# Altium project WifiAndLcd.PrjPCB
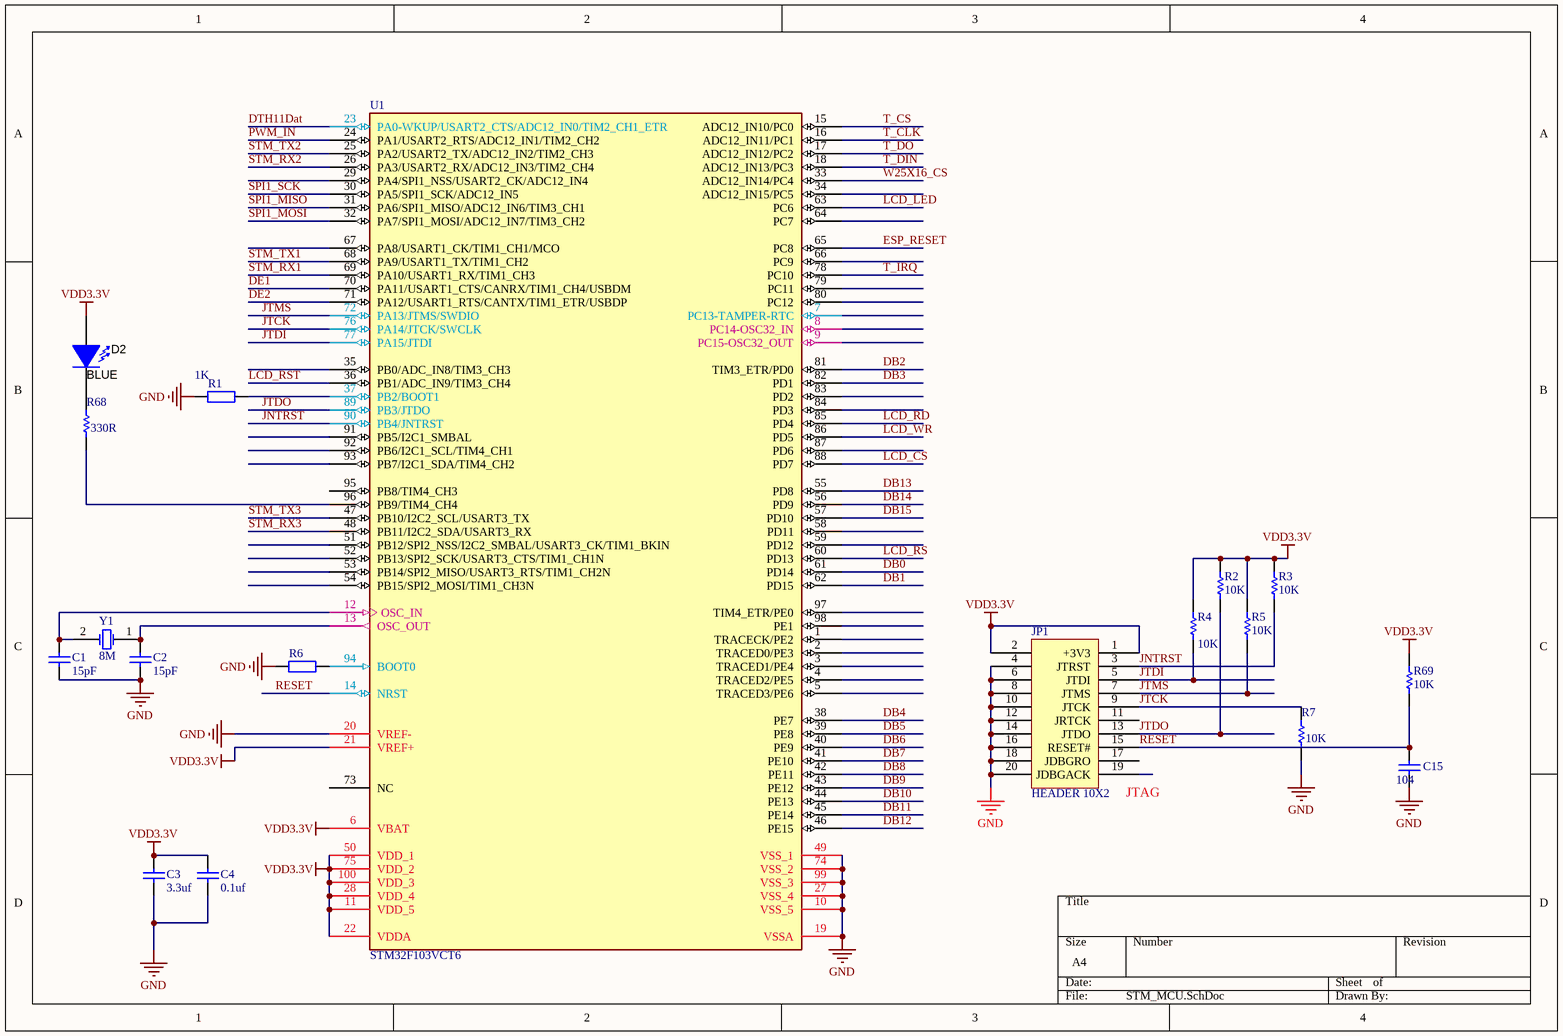
[diagram p0: STM_MCU.SchDoc]
3 sheets, 130 parts. Net scope: global (net labels, ports and power ports of the same name join across sheets).
Board file: WifiAndLcd.PcbDoc
Sheets:
  STM_MCU.SchDoc
  MAX485.SchDoc
  WifiAndPower.SchDoc

## Sheet STM_MCU.SchDoc
size A4

### Parts
C1  value 15pF  [C0805]  (hidden comment: Cap)
C2  value 15pF  [C0805]  (hidden comment: Cap)
C3  value 3.3uf  [C0805]  (hidden comment: Cap)
C4  value 0.1uf  [C0805]  (hidden comment: Cap)
C15  104  [C0805]
D2  value BLUE  [D0805]  (hidden comment: SML-P12YTT86)
JP1  HEADER 10X2  [STM32-JLINK]
R1  value 1K  [0805]  (hidden comment: Res2)
R2  value 10K  [0805]  (hidden comment: Res Semi)
R3  value 10K  [0805]  (hidden comment: Res Semi)
R4  value 10K  [0805]  (hidden comment: Res Semi)
R5  value 10K  [0805]  (hidden comment: Res Semi)
R6  Res2  [0805]  (value not drawn)
R7  value 10K  [0805]  (hidden comment: Res Semi)
R68  value 330R  [0805]  (hidden comment: Res Semi)
R69  10K  [0805]
U1  STM32F103VCT6  [LQFP100_M]
Y1  XTAL  [CY]  (value not drawn)

### Nets
GND: C1.1 C2.1 C3.2 C4.2 C15.1 JP1.4 JP1.6 JP1.8 JP1.10 JP1.12 JP1.14 JP1.16 JP1.18 JP1.20 R1.1 R6.1 R7.1 U1.10(VSS_5) U1.19(VSSA) U1.20(VREF-) U1.27(VSS_4) U1.49(VSS_1) U1.74(VSS_2) U1.99(VSS_3)
VDD3.3V: C3.1 C4.1 D2.1(A) JP1.1(+3V3) JP1.2 R2.2 R3.2 R4.2 R5.2 R69.2 U1.6(VBAT) U1.11(VDD_5) U1.21(VREF+) U1.22(VDDA) U1.28(VDD_4) U1.50(VDD_1) U1.75(VDD_2) U1.100(VDD_3)
DB0: U1.61(PD14)
DB1: U1.62(PD15)
DB2: U1.81(TIM3_ETR/PD0)
DB3: U1.82(PD1)
DB4: U1.38(PE7)
DB5: U1.39(PE8)
DB6: U1.40(PE9)
DB7: U1.41(PE10)
DB8: U1.42(PE11)
DB9: U1.43(PE12)
DB10: U1.44(PE13)
DB11: U1.45(PE14)
DB12: U1.46(PE15)
DB13: U1.55(PD8)
DB14: U1.56(PD9)
DB15: U1.57(PD10)
DE1: U1.70(PA11/USART1_CTS/CANRX/TIM1_CH4/USBDM)
DE2: U1.71(PA12/USART1_RTS/CANTX/TIM1_ETR/USBDP)
DTH11Dat: U1.23(PA0-WKUP/USART2_CTS/ADC12_IN0/TIM2_CH1_ETR)
ESP_RESET: U1.65(PC8)
JNTRST: JP1.3(JTRST) R3.1 U1.90(PB4/JNTRST)
JTCK: JP1.9(JTCK) R7.2 U1.76(PA14/JTCK/SWCLK)
JTDI: JP1.5(JTDI) R4.1 U1.77(PA15/JTDI)
JTDO: JP1.13(JTDO) R2.1 U1.89(PB3/JTDO)
JTMS: JP1.7(JTMS) R5.1 U1.72(PA13/JTMS/SWDIO)
LCD_CS: U1.88(PD7)
LCD_LED: U1.63(PC6)
LCD_RD: U1.85(PD4)
LCD_RS: U1.60(PD13)
LCD_RST: U1.36(PB1/ADC_IN9/TIM3_CH4)
LCD_WR: U1.86(PD5)
PWM_IN: U1.24(PA1/USART2_RTS/ADC12_IN1/TIM2_CH2)
RESET: C15.2 JP1.15(RESET#) R69.1 U1.14(NRST)
SPI1_MISO: U1.31(PA6/SPI1_MISO/ADC12_IN6/TIM3_CH1)
SPI1_MOSI: U1.32(PA7/SPI1_MOSI/ADC12_IN7/TIM3_CH2)
SPI1_SCK: U1.30(PA5/SPI1_SCK/ADC12_IN5)
STM_RX1: U1.69(PA10/USART1_RX/TIM1_CH3)
STM_RX2: U1.26(PA3/USART2_RX/ADC12_IN3/TIM2_CH4)
STM_RX3: U1.48(PB11/I2C2_SDA/USART3_RX)
STM_TX1: U1.68(PA9/USART1_TX/TIM1_CH2)
STM_TX2: U1.25(PA2/USART2_TX/ADC12_IN2/TIM2_CH3)
STM_TX3: U1.47(PB10/I2C2_SCL/USART3_TX)
T_CLK: U1.16(ADC12_IN11/PC1)
T_CS: U1.15(ADC12_IN10/PC0)
T_DIN: U1.18(ADC12_IN13/PC3)
T_DO: U1.17(ADC12_IN12/PC2)
T_IRQ: U1.78(PC10)
W25X16_CS: U1.33(ADC12_IN14/PC4)
NetC1_2: C1.2 U1.12(OSC_IN) Y1.2(OSC2)
NetC2_2: C2.2 U1.13(OSC_OUT) Y1.1(OSC1)
NetD2_2: D2.2(K) R68.2
NetR1_2: R1.2 U1.37(PB2/BOOT1)
NetR6_2: R6.2 U1.94(BOOT0)
NetR68_1: R68.1 U1.96(PB9/TIM4_CH4)

Not connected (* = marked no-connect by the designer): JP1 11(JRTCK) 17(JDBGRO) 19(JDBGACK); U1 1(TRACECK/PE2) 2(TRACED0/PE3) 3(TRACED1/PE4) 4(TRACED2/PE5) 5(TRACED3/PE6) 7(PC13-TAMPER-RTC) 8(PC14-OSC32_IN) 9(PC15-OSC32_OUT) 29(PA4/SPI1_NSS/USART2_CK/ADC12_IN4) 34(ADC12_IN15/PC5) 35(PB0/ADC_IN8/TIM3_CH3) 51(PB12/SPI2_NSS/I2C2_SMBAL/USART3_CK/TIM1_BKIN) 52(PB13/SPI2_SCK/USART3_CTS/TIM1_CH1N) 53(PB14/SPI2_MISO/USART3_RTS/TIM1_CH2N) 54(PB15/SPI2_MOSI/TIM1_CH3N) 58(PD11) 59(PD12) 64(PC7) 66(PC9) 67(PA8/USART1_CK/TIM1_CH1/MCO) 73(NC) 79(PC11) 80(PC12) 83(PD2) 84(PD3) 87(PD6) 91(PB5/I2C1_SMBAL) 92(PB6/I2C1_SCL/TIM4_CH1) 93(PB7/I2C1_SDA/TIM4_CH2) 95(PB8/TIM4_CH3) 97(TIM4_ETR/PE0) 98(PE1)

### Notes on the sheet
- (near JP1) JTAG
- (in symbol XTAL) 8M

### Library data of the parts
C1 C2 = Cap: Capacitor; Published: 8-Jun-2000; LatestRevisionDate: 17-Jul-2002; LatestRevisionNote: Re-released for DXP Platform.; PackageReference: RAD-0.3; Publisher: Altium Limited
C3 C4 = Cap: Capacitor; Manufacturer: Generic Components; Class: Passive; Published: 08/06/2000; Publisher: Altium Hobart Technology Centre; SubClass: Capacitor
C15 = Cap_2: Capacitor; Published: 8-Jun-2000; LatestRevisionDate: 17-Jul-2002; LatestRevisionNote: Re-released for DXP Platform.; Publisher: Altium Limited
D2 = SML-P12YTT86: LED, GREEN SMD; Manufacturer: Rohm; Type: InGaN; Vf_V: 2.1; Value2: 2.1V; Io_A: 0.02; Tjmax_C: 85; Value1: W; Color: yellow; U/M: EA; CompType: LED; PartNumber: SML-P12YTT86; SymbolVersion: 2008-12-08; MountType: SMT; RoHS: Y; PackageReference: Yellow LED; Published: 2008-07-11; Publisher: Texas Instruments; ComponentLink1URL: http://rohmfs.rohm.com/en/products/databook/datasheet/opto/led/chip_mono/sml-p1.pdf; ComponentLink1Description: Datasheet link; LatestRevisionDate: 2013-06-24; LatestRevisionNote: Updated supplier queries; Supplier 1: Digi-Key; Supplier Part Number 1: 511-1595-1-ND; Supplier 2: Mouser; Supplier Part Number 2: 755-SML-P12YTT86; Supplier 3: Farnell; Supplier Part Number 3: 1973107
R1 = RES
R2-R5 R7 R68 R69 = Res Semi: Semiconductor Resistor; Published: 8-Jun-2000; LatestRevisionDate: 17-Jul-2002; LatestRevisionNote: Re-released for DXP Platform.; PackageReference: AXIAL-0.5; Publisher: Altium Limited
  R69: Value: 10K
R6 = RES: Value: 10K
U1 = STM32F103VBT6: STM32 ARM-based 32-bit MCU with 64 Kbytes Flash, 100-pin LQFP, Industrial Temperature; Published: *; DatasheetVersion: *; PackageVersion: *; PackageReference: *; Publisher: *; PackageDescription: *; ComponentLink1Description: *; ComponentLink1URL: *; ComponentLink2Description: *; ComponentLink2URL: *
Y1 = XTAL: Crystal Oscillator; Published: 8-Jun-2000; LatestRevisionDate: 17-Jul-2002; LatestRevisionNote: Re-released for DXP Platform.; PackageReference: R38; Publisher: Altium Limited

## Sheet MAX485.SchDoc
size A4
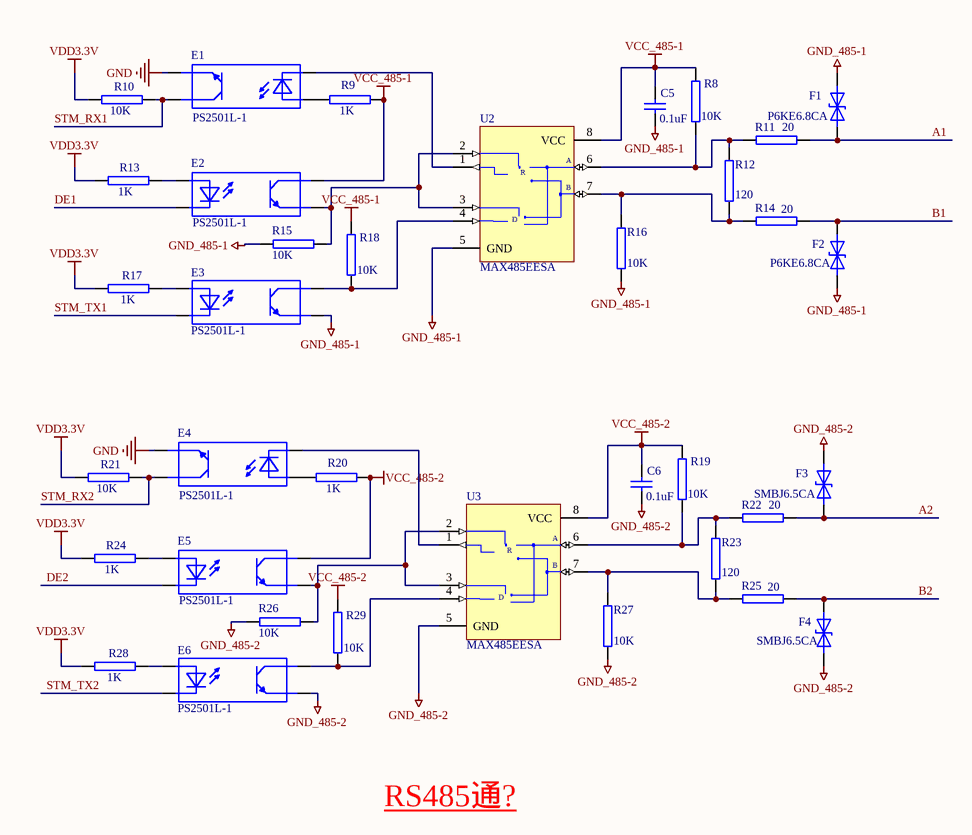
[diagram p1: MAX485.SchDoc]

### Parts
C5  value 0.1uF  [C0805]  (hidden comment: Cap)
C6  value 0.1uF  [C0805]  (hidden comment: Cap)
E1  PS2501L-1  [NEC2501]
E2  PS2501L-1  [NEC2501]
E3  PS2501L-1  [NEC2501]
E4  PS2501L-1  [NEC2501]
E5  PS2501L-1  [NEC2501]
E6  PS2501L-1  [NEC2501]
F1  P6KE6.8CA  [P6KE6,8CA]
F2  P6KE6.8CA  [P6KE6,8CA]
F3  SMBJ6.5CA  [P6KE6,8CA]
F4  SMBJ6.5CA  [P6KE6,8CA]
R8  10K  [0805]
R9  1K  [0805]
R10  10K  [0805]
R11  20  [0805]
R12  120  [0805]
R13  1K  [0805]
R14  20  [0805]
R15  10K  [0805]
R16  10K  [0805]
R17  1K  [0805]
R18  10K  [0805]
R19  10K  [0805]
R20  1K  [0805]
R21  10K  [0805]
R22  20  [0805]
R23  120  [0805]
R24  1K  [0805]
R25  20  [0805]
R26  10K  [0805]
R27  10K  [0805]
R28  1K  [0805]
R29  10K  [0805]
U2  MAX485EESA  [NSO8]
U3  MAX485EESA  [NSO8]

### Nets
GND: E1.3 E4.3
GND_485-1: C5.1 E3.3 F1.1 F2.2 R15.2 R16.1 U2.5(GND)
GND_485-2: C6.1 E6.3 F3.1 F4.2 R26.2 R27.1 U3.5(GND)
VCC_485-1: C5.2 E2.4 R8.2 R9.1 R18.2 U2.8(VCC)
VCC_485-2: C6.2 E5.4 R19.2 R20.1 R29.2 U3.8(VCC)
VDD3.3V: R10.2 R13.2 R17.2 R21.2 R24.2 R28.2
A1: F1.2 R11.2
A2: F3.2 R22.2
B1: F2.1 R14.2
B2: F4.1 R25.2
DE1: E2.2
DE2: E5.2
STM_RX1: E1.4 R10.1
STM_RX2: E4.4 R21.1
STM_TX1: E3.2
STM_TX2: E6.2
NetE1_1: E1.1 R9.2
NetE1_2: E1.2 U2.1(RO)
NetE2_1: E2.1 R13.1
NetE2_3: E2.3 R15.1 U2.2(~{RE}) U2.3(DE)
NetE3_1: E3.1 R17.1
NetE3_4: E3.4 R18.1 U2.4(DI)
NetE4_1: E4.1 R20.2
NetE4_2: E4.2 U3.1(RO)
NetE5_1: E5.1 R24.1
NetE5_3: E5.3 R26.1 U3.2(~{RE}) U3.3(DE)
NetE6_1: E6.1 R28.1
NetE6_4: E6.4 R29.1 U3.4(DI)
NetR8_1: R8.1 R11.1 R12.2 U2.6(A)
NetR12_1: R12.1 R14.1 R16.2 U2.7(B)
NetR19_1: R19.1 R22.1 R23.2 U3.6(A)
NetR23_1: R23.1 R25.1 R27.2 U3.7(B)

### Notes on the sheet
- RS485通?
- (in symbol MAX485ESA) R; D

### Library data of the parts
C5 C6 = Cap: Capacitor; Published: 8-Jun-2000; LatestRevisionDate: 17-Jul-2002; LatestRevisionNote: Re-released for DXP Platform.; Publisher: Altium Limited
E1-E6 = OP: 光耦
F1-F4 = TVS: 快速瞬变二极管
R8-R29 = RES2
U2 U3 = MAX485ESA: Low-Power, Slew-Rate-Limited RS-485/RS-422 Transceiver; Code - JEDEC: MS-012-AA; Code - IPC: SO8; Published: 16-Jan-2001; Revision: 17-Jul-2002: Re-released for DXP Platform.; Datasheet: Latest Revision: Feb-1996; Package Reference: NSO8; Publisher: Altium Limited

## Sheet WifiAndPower.SchDoc
size A4
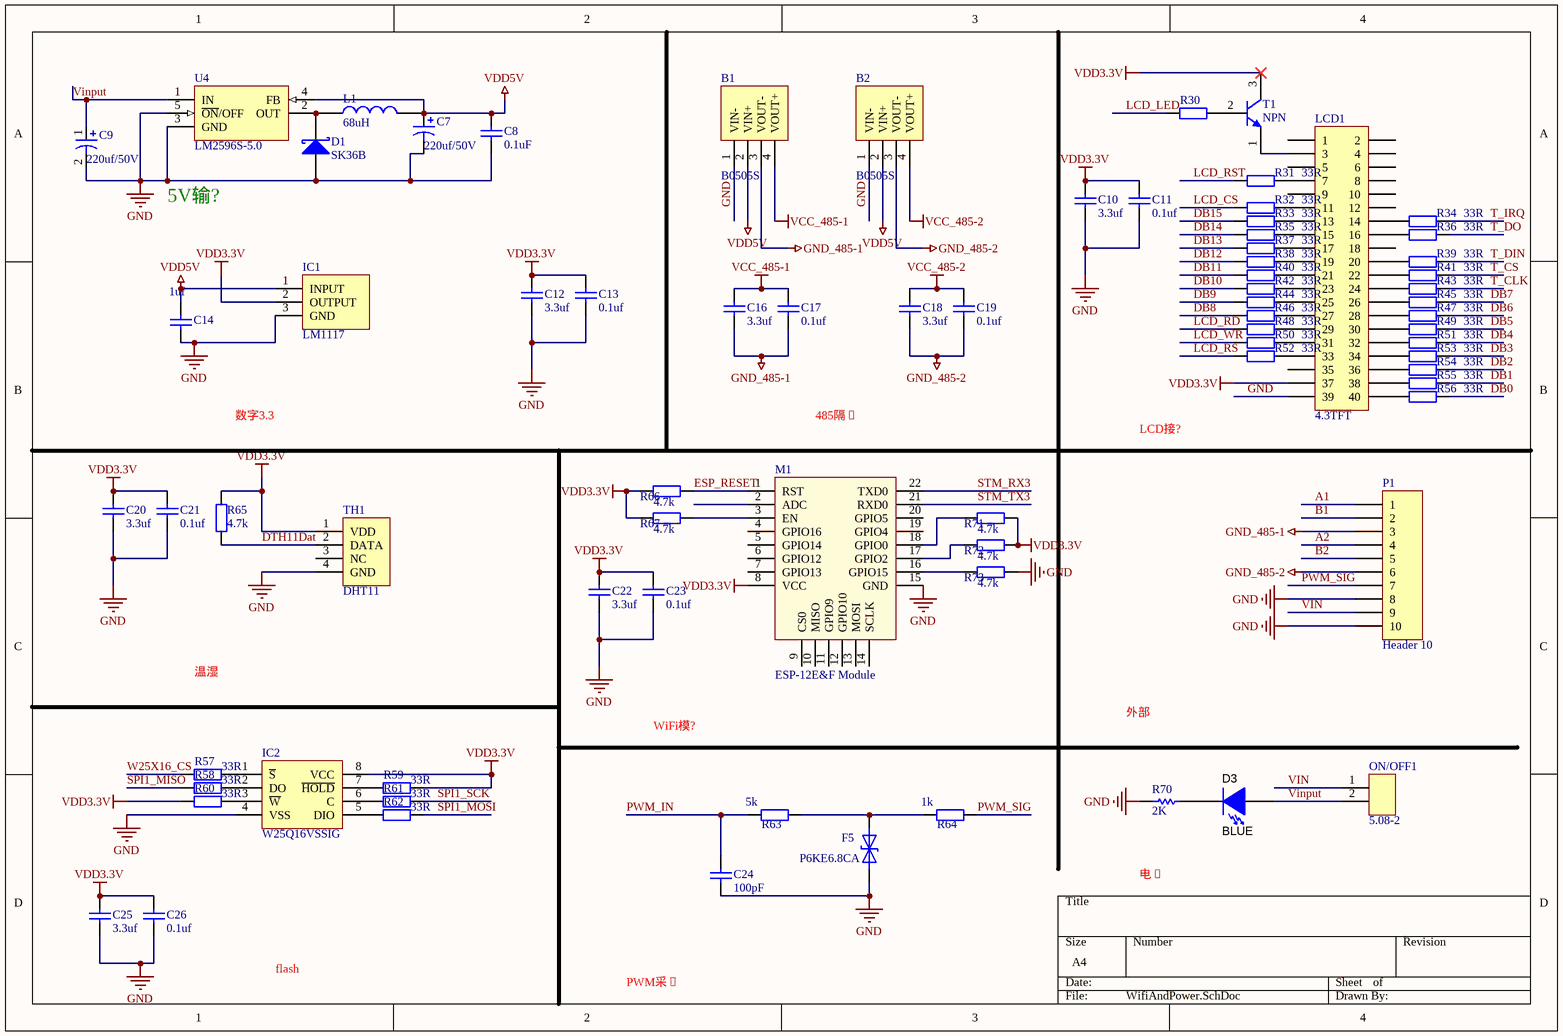
[diagram p2: WifiAndPower.SchDoc]

### Parts
B1  B0505S  [B0505S]
B2  B0505S  [B0505S]
C7  value 220uf/50V  [PLAS8*10]  (hidden comment: Cap Pol1)
C8  value 0.1uF  [C0805]  (hidden comment: Cap)
C9  value 220uf/50V  [PLAS8*10]  (hidden comment: Cap Pol1)
C10  value 3.3uf  [C0805]  (hidden comment: Cap)
C11  value 0.1uf  [C0805]  (hidden comment: Cap)
C12  value 3.3uf  [C0805]  (hidden comment: Cap)
C13  value 0.1uf  [C0805]  (hidden comment: Cap)
C14  value 1uf  [C0805]  (hidden comment: Cap)
C16  value 3.3uf  [C0805]  (hidden comment: Cap)
C17  value 0.1uf  [C0805]  (hidden comment: Cap)
C18  value 3.3uf  [C0805]  (hidden comment: Cap)
C19  value 0.1uf  [C0805]  (hidden comment: Cap)
C20  value 3.3uf  [C0805]  (hidden comment: Cap)
C21  value 0.1uf  [C0805]  (hidden comment: Cap)
C22  value 3.3uf  [C0805]  (hidden comment: Cap)
C23  value 0.1uf  [C0805]  (hidden comment: Cap)
C24  value 100pF  [C0805]  (hidden comment: Cap)
C25  value 3.3uf  [C0805]  (hidden comment: Cap)
C26  value 0.1uf  [C0805]  (hidden comment: Cap)
D1  SK36B  [SMB]
D3  value BLUE  [D0805]  (hidden comment: SML-P12YTT86)
F5  P6KE6.8CA  [P6KE6,8CA]
IC1  LM1117  [LM1117]
IC2  W25Q16VSSIG  [wsop8]
L1  68uH  [PCBH101]
LCD1  4.3TFT  [2.4TFT]
M1  ESP-12E&F Module  [ESP-12E&F Module]
ON/OFF1  5.08-2  [SensorA]
P1  Header 10  [3.5-10]
R30  Res2  [0805]  (value not drawn)
R31  value 33R  [0805]  (hidden comment: Res2)
R32  value 33R  [0805]  (hidden comment: Res2)
R33  value 33R  [0805]  (hidden comment: Res2)
R34  value 33R  [0805]  (hidden comment: Res2)
R35  value 33R  [0805]  (hidden comment: Res2)
R36  value 33R  [0805]  (hidden comment: Res2)
R37  value 33R  [0805]  (hidden comment: Res2)
R38  value 33R  [0805]  (hidden comment: Res2)
R39  value 33R  [0805]  (hidden comment: Res2)
R40  value 33R  [0805]  (hidden comment: Res2)
R41  value 33R  [0805]  (hidden comment: Res2)
R42  value 33R  [0805]  (hidden comment: Res2)
R43  value 33R  [0805]  (hidden comment: Res2)
R44  value 33R  [0805]  (hidden comment: Res2)
R45  value 33R  [0805]  (hidden comment: Res2)
R46  value 33R  [0805]  (hidden comment: Res2)
R47  value 33R  [0805]  (hidden comment: Res2)
R48  value 33R  [0805]  (hidden comment: Res2)
R49  value 33R  [0805]  (hidden comment: Res2)
R50  value 33R  [0805]  (hidden comment: Res2)
R51  value 33R  [0805]  (hidden comment: Res2)
R52  value 33R  [0805]  (hidden comment: Res2)
R53  value 33R  [0805]  (hidden comment: Res2)
R54  value 33R  [0805]  (hidden comment: Res2)
R55  value 33R  [0805]  (hidden comment: Res2)
R56  value 33R  [0805]  (hidden comment: Res2)
R57  value 33R  [0805]  (hidden comment: Res2)
R58  value 33R  [0805]  (hidden comment: Res2)
R59  value 33R  [0805]  (hidden comment: Res2)
R60  value 33R  [0805]  (hidden comment: Res2)
R61  value 33R  [0805]  (hidden comment: Res2)
R62  value 33R  [0805]  (hidden comment: Res2)
R63  value 5k  [0805]  (hidden comment: RES)
R64  value 1k  [0805]  (hidden comment: RES)
R65  value 4.7k  [0805]  (hidden comment: Res2)
R66  value 4.7k  [0805]  (hidden comment: Res2)
R67  value 4.7k  [0805]  (hidden comment: Res2)
R70  value 2K  [0805]  (hidden comment: Res Semi)
R71  value 4.7k  [0805]  (hidden comment: Res2)
R72  value 4.7k  [0805]  (hidden comment: Res2)
R73  value 4.7k  [0805]  (hidden comment: Res2)
T1  NPN  [2N3904]
TH1  DHT11  [DHT11]
U4  LM2596S-5.0  [TS5B_M]

### Nets
GND: B1.1(VIN-) B2.1(VIN-) C7.2 C8.1 C9.2 C10.2 C11.2 C12.2 C13.2 C14.2 C20.2 C21.2 C22.2 C23.2 C24.2 C25.2 C26.2 D1.1(A) F5.2 IC1.3(GND) IC2.4(VSS) LCD1.39 M1.15(GND) P1.8 P1.10 R70.2 R73.1 TH1.4(GND) U4.3(GND) U4.5(~{ON}/OFF)
GND_485-1: B1.3(VOUT-) C16.2 C17.2 P1.3
GND_485-2: B2.3(VOUT-) C18.2 C19.2 P1.6
VCC_485-1: B1.4(VOUT+) C16.1 C17.1
VCC_485-2: B2.4(VOUT+) C18.1 C19.1
VDD3.3V: C10.1 C11.1 C12.1 C13.1 C20.1 C21.1 C22.1 C23.1 C25.1 C26.1 IC1.2(OUTPUT) IC2.8(VCC) LCD1.37 M1.8(VCC) R59.2 R60.1 R65.2 R66.2 R67.2 R71.1 R72.1 T1.3(C) TH1.1(VDD)
VDD5V: B1.2(VIN+) B2.2(VIN+) C7.1 C8.2 C14.1 IC1.1(INPUT) L1.2 U4.4(FB)
A1: P1.1
A2: P1.4
B1: P1.2
B2: P1.5
DB0: R56.2
DB1: R55.2
DB2: R54.2
DB3: R53.2
DB4: R51.2
DB5: R49.2
DB6: R47.2
DB7: R45.2
DB8: R46.1
DB9: R44.1
DB10: R42.1
DB11: R40.1
DB12: R38.1
DB13: R37.1
DB14: R35.1
DB15: R33.1
DTH11Dat: R65.1 TH1.2(DATA)
ESP_RESET: M1.1(RST) R66.1
LCD_CS: R32.1
LCD_LED: R30.1
LCD_RD: R48.1
LCD_RS: R52.1
LCD_RST: R31.1
LCD_WR: R50.1
PWM_IN: C24.1 R63.2
PWM_SIG: P1.7 R64.1
SPI1_MISO: R58.1
SPI1_MOSI: R62.2
SPI1_SCK: R61.2
STM_RX3: M1.22(TXD0)
STM_TX3: M1.21(RXD0)
T_CLK: R43.2
T_CS: R41.2
T_DIN: R39.2
T_DO: R36.2
T_IRQ: R34.2
VIN: ON/OFF1.1 P1.9
Vinput: C9.1 D3.1(A) ON/OFF1.2 U4.1(IN)
W25X16_CS: R57.1
NetD1_2: D1.2(K) L1.1 U4.2(OUT)
NetD3_2: D3.2(K) R70.1
NetF5_1: F5.1 R63.1 R64.2
NetIC2_1: IC2.1(~{S}) R57.2
NetIC2_2: IC2.2(DO) R58.2
NetIC2_3: IC2.3(~{W}) R60.2
NetIC2_5: IC2.5(DIO) R62.1
NetIC2_6: IC2.6(C) R61.1
NetIC2_7: IC2.7(~{HOLD}) R59.1
NetLCD1_3: LCD1.3 T1.1(E)
NetLCD1_7: LCD1.7 R31.2
NetLCD1_11: LCD1.11 R32.2
NetLCD1_13: LCD1.13 R33.2
NetLCD1_14: LCD1.14 R34.1
NetLCD1_15: LCD1.15 R35.2
NetLCD1_16: LCD1.16 R36.1
NetLCD1_17: LCD1.17 R37.2
NetLCD1_19: LCD1.19 R38.2
NetLCD1_20: LCD1.20 R39.1
NetLCD1_21: LCD1.21 R40.2
NetLCD1_22: LCD1.22 R41.1
NetLCD1_23: LCD1.23 R42.2
NetLCD1_24: LCD1.24 R43.1
NetLCD1_25: LCD1.25 R44.2
NetLCD1_26: LCD1.26 R45.1
NetLCD1_27: LCD1.27 R46.2
NetLCD1_28: LCD1.28 R47.1
NetLCD1_29: LCD1.29 R48.2
NetLCD1_30: LCD1.30 R49.1
NetLCD1_31: LCD1.31 R50.2
NetLCD1_32: LCD1.32 R51.1
NetLCD1_33: LCD1.33 R52.2
NetLCD1_34: LCD1.34 R53.1
NetLCD1_36: LCD1.36 R54.1
NetLCD1_38: LCD1.38 R55.1
NetLCD1_40: LCD1.40 R56.1
NetM1_3: M1.3(EN) R67.1
NetM1_16: M1.16(GPIO15) R73.2
NetM1_17: M1.17(GPIO2) R72.2
NetM1_18: M1.18(GPIO0) R71.2
NetR30_2: R30.2 T1.2(B)

Not connected (* = marked no-connect by the designer): LCD1 1 2 4 5 6 8 9 10 12 18 35; M1 2(ADC) 4(GPIO16) 5(GPIO14) 6(GPIO12) 7(GPIO13) 9(CS0) 10(MISO) 11(GPIO9) 12(GPIO10) 13(MOSI) 14(SCLK) 19(GPIO4) 20(GPIO5); TH1 3(NC)

### Notes on the sheet
- 5V输?
- 数字3.3
- 485隔�
- LCD接?
- 温湿
- 外部
- WiFi模?
- 电�
- flash
- PWM采�

### Library data of the parts
C7 C9 = Cap Pol1: Polarized Capacitor (Radial); Published: 8-Jun-2000; LatestRevisionDate: 17-Jul-2002; LatestRevisionNote: Re-released for DXP Platform.; PackageReference: RB7.6-15; Publisher: Altium Limited
C8 = Cap_2: Capacitor; Published: 8-Jun-2000; LatestRevisionDate: 17-Jul-2002; LatestRevisionNote: Re-released for DXP Platform.; Publisher: Altium Limited
C10-C14 C16-C26 = Cap: as C3 on sheet STM_MCU; Published: 08/06/2000; Publisher: Altium Hobart Technology Centre; SubClass: Capacitor
D1 = D Schottky: Schottky Diode; Published: 8-Jun-2000; LatestRevisionDate: 17-Jul-2002; LatestRevisionNote: Re-released for DXP Platform.; PackageReference: SMB; Publisher: Altium Limited; Code_JEDEC: DO-214-AA
D3 = SML-P12YTT86: as D2 on sheet STM_MCU; CompType: LED; PartNumber: SML-P12YTT86; SymbolVersion: 2008-12-08; MountType: SMT; RoHS: Y; PackageReference: Yellow LED; Published: 2008-07-11; Publisher: Texas Instruments; ComponentLink1URL: http://rohmfs.rohm.com/en/products/databook/datasheet/opto/led/chip_mono/sml-p1.pdf; ComponentLink1Description: Datasheet link; LatestRevisionDate: 2013-06-24; LatestRevisionNote: Updated supplier queries; Supplier 1: Digi-Key; Supplier Part Number 1: 511-1595-1-ND; Supplier 2: Mouser; Supplier Part Number 2: 755-SML-P12YTT86; Supplier 3: Farnell; Supplier Part Number 3: 1973107
F5 = TVS: 快速瞬变二极管
IC2 = A25L080
L1 = INDUCT
P1 = Header 10: Header, 10-Pin; LatestRevisionDate: 17-Jul-2002; LatestRevisionNote: Re-released for DXP Platform.; Publisher: Altium Limited
R30 = RES: Value: 1K
R31-R62 R65-R67 R71-R73 = RES
R70 = Res Semi: Semiconductor Resistor; Published: 8-Jun-2000; LatestRevisionDate: 17-Jul-2002; LatestRevisionNote: Re-released for DXP Platform.; PackageReference: AXIAL-0.5; Publisher: Altium Limited
U4 = LM2596S-5.0: Simple Switcher Power Converter 150 kHz 3A Step Down Voltage Regulator; Note: Tab is connected to GND; Published: 15-Apr-2002; DatasheetVersion: Dec-1997; PackageReference: TS5B; Publisher: Altium Limited; PackageDescription: D2-PAK; 5 Leads; Body 14.4 (inc. leads) x 10.4 mm (LxW max); ComponentLink1Description: Manufacturer Link; ComponentLink1URL: http://www.national.com/; ComponentLink2Description: Datasheet; ComponentLink2URL: http://www.national.com/ds.cgi/LM/LM2596.pdf; ComponentLink3Description: URL Link1; ComponentLink3URL: http://www.national.com/pf/LM/LM2596.html

## Nets that join several sheets
GND: STM_MCU (24 pins), MAX485 (E1.3 E4.3), WifiAndPower (30 pins)
GND_485-1: MAX485 (7 pins), WifiAndPower (B1.3 C16.2 C17.2 P1.3)
GND_485-2: MAX485 (7 pins), WifiAndPower (B2.3 C18.2 C19.2 P1.6)
VCC_485-1: MAX485 (6 pins), WifiAndPower (B1.4 C16.1 C17.1)
VCC_485-2: MAX485 (6 pins), WifiAndPower (B2.4 C18.1 C19.1)
VDD3.3V: STM_MCU (18 pins), MAX485 (6 pins), WifiAndPower (23 pins)
A1: MAX485 (F1.2 R11.2), WifiAndPower (P1.1)
A2: MAX485 (F3.2 R22.2), WifiAndPower (P1.4)
B1: MAX485 (F2.1 R14.2), WifiAndPower (P1.2)
B2: MAX485 (F4.1 R25.2), WifiAndPower (P1.5)
DB0: STM_MCU (U1.61), WifiAndPower (R56.2)
DB1: STM_MCU (U1.62), WifiAndPower (R55.2)
DB2: STM_MCU (U1.81), WifiAndPower (R54.2)
DB3: STM_MCU (U1.82), WifiAndPower (R53.2)
DB4: STM_MCU (U1.38), WifiAndPower (R51.2)
DB5: STM_MCU (U1.39), WifiAndPower (R49.2)
DB6: STM_MCU (U1.40), WifiAndPower (R47.2)
DB7: STM_MCU (U1.41), WifiAndPower (R45.2)
DB8: STM_MCU (U1.42), WifiAndPower (R46.1)
DB9: STM_MCU (U1.43), WifiAndPower (R44.1)
DB10: STM_MCU (U1.44), WifiAndPower (R42.1)
DB11: STM_MCU (U1.45), WifiAndPower (R40.1)
DB12: STM_MCU (U1.46), WifiAndPower (R38.1)
DB13: STM_MCU (U1.55), WifiAndPower (R37.1)
DB14: STM_MCU (U1.56), WifiAndPower (R35.1)
DB15: STM_MCU (U1.57), WifiAndPower (R33.1)
DE1: STM_MCU (U1.70), MAX485 (E2.2)
DE2: STM_MCU (U1.71), MAX485 (E5.2)
DTH11Dat: STM_MCU (U1.23), WifiAndPower (R65.1 TH1.2)
ESP_RESET: STM_MCU (U1.65), WifiAndPower (M1.1 R66.1)
LCD_CS: STM_MCU (U1.88), WifiAndPower (R32.1)
LCD_LED: STM_MCU (U1.63), WifiAndPower (R30.1)
LCD_RD: STM_MCU (U1.85), WifiAndPower (R48.1)
LCD_RS: STM_MCU (U1.60), WifiAndPower (R52.1)
LCD_RST: STM_MCU (U1.36), WifiAndPower (R31.1)
LCD_WR: STM_MCU (U1.86), WifiAndPower (R50.1)
PWM_IN: STM_MCU (U1.24), WifiAndPower (C24.1 R63.2)
SPI1_MISO: STM_MCU (U1.31), WifiAndPower (R58.1)
SPI1_MOSI: STM_MCU (U1.32), WifiAndPower (R62.2)
SPI1_SCK: STM_MCU (U1.30), WifiAndPower (R61.2)
STM_RX1: STM_MCU (U1.69), MAX485 (E1.4 R10.1)
STM_RX2: STM_MCU (U1.26), MAX485 (E4.4 R21.1)
STM_RX3: STM_MCU (U1.48), WifiAndPower (M1.22)
STM_TX1: STM_MCU (U1.68), MAX485 (E3.2)
STM_TX2: STM_MCU (U1.25), MAX485 (E6.2)
STM_TX3: STM_MCU (U1.47), WifiAndPower (M1.21)
T_CLK: STM_MCU (U1.16), WifiAndPower (R43.2)
T_CS: STM_MCU (U1.15), WifiAndPower (R41.2)
T_DIN: STM_MCU (U1.18), WifiAndPower (R39.2)
T_DO: STM_MCU (U1.17), WifiAndPower (R36.2)
T_IRQ: STM_MCU (U1.78), WifiAndPower (R34.2)
W25X16_CS: STM_MCU (U1.33), WifiAndPower (R57.1)